# EAGLE design PCB-TBAR-BORADC (EAGLE 7.7.0)
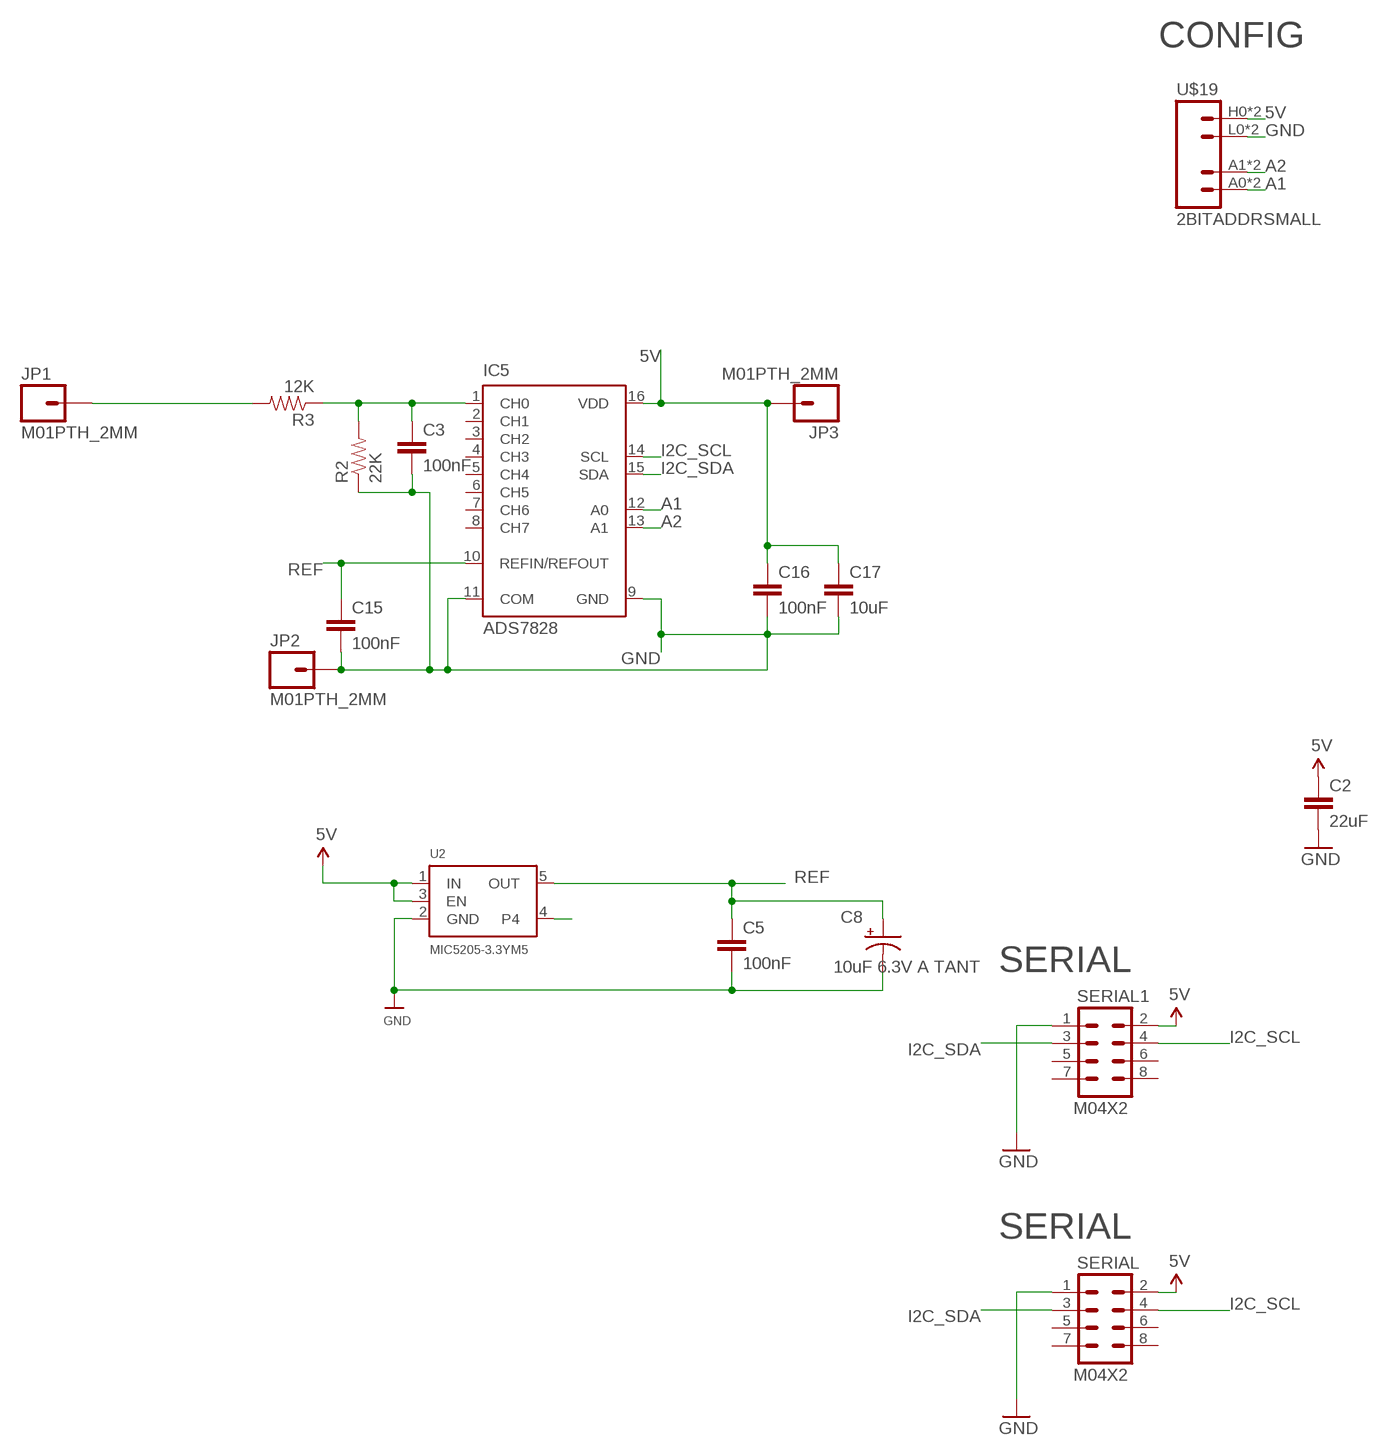
[diagram p0: schematic, sheet 1]

## Parts
C2  22uF  CAP0805  [0805]
C3  100nF  CAP0603-CAP  [0603-CAP]
C5  100nF  CAP0603-CAP  [0603-CAP]
C8  10uF 6.3V A TANT  CAP_POL1206  [EIA3216]
C15  100nF  CAP0603-CAP  [0603-CAP]
C16  100nF  CAP0603-CAP  [0603-CAP]
C17  10uF  CAP0805  [0805]
IC5  ADS7828  [TSSOP16-PW]
JP1  M01PTH_2MM  [1X01_2MM]
JP2  M01PTH_2MM  [1X01_2MM]
JP3  M01PTH_2MM  [1X01_2MM]
R2  22K  RESISTOR0603-RES  [0603-RES]
R3  12K  RESISTOR0603-RES  [0603-RES]
SERIAL  M04X2  [2X4]
SERIAL1  M04X2  [2X4]
U2  MIC5205-3.3YM5  VREG_SOT23-5  [SOT23-5]
U$19  2BITADDRSMALL  [2BITADDR_SMALL]

## Nets
5V [Power]: C2.1 C16.1 C17.1 IC5.16(VDD) JP3.1 SERIAL1.2 SERIAL.2 U2.1(IN) U2.3(EN) U$19.H0(VCC) U$19.H1(VCC)
A1: IC5.12(A0) U$19.A0(A1) U$19.AS0(A1)
A2: IC5.13(A1) U$19.A1(A2) U$19.AS1(A2)
GND [Power]: C2.2 C3.2 C5.2 C8.C(-) C15.2 C16.2 C17.2 IC5.9(GND) IC5.11(COM) JP2.1 R2.1 SERIAL1.1 SERIAL.1 U2.2(GND) U$19.L0(GND) U$19.L1(GND)
I2C_SCL: IC5.14(SCL) SERIAL1.4 SERIAL.4
I2C_SDA: IC5.15(SDA) SERIAL1.3 SERIAL.3
N$1: C3.1 IC5.1(CH0) R2.2 R3.1
N$2: JP1.1 R3.2
N$3 [Power]: U2.4
REF [Power]: C5.1 C8.A(+) C15.1 IC5.10(REFIN/REFOUT) U2.5(OUT)
Unconnected: IC5.2(CH1) IC5.3(CH2) IC5.4(CH3) IC5.5(CH4) IC5.6(CH5) IC5.7(CH6) IC5.8(CH7) SERIAL1.5 SERIAL1.6 SERIAL1.7 SERIAL1.8 SERIAL.5 SERIAL.6 SERIAL.7 SERIAL.8

## Notes on the sheet
- CONFIG
- SERIAL
- SERIAL

## Library data of the parts
C2 C3 C5 C15-C17 = SparkFun:CAP: Capacitor Standard 0603 ceramic capacitor, and 0.1" leaded capacitor.
C8 = freetronics:CAP_POL: Capacitor Polarized These are standard SMD and PTH capacitors. Normally 10uF, 47uF, and 100uF in electrolytic and tantalum varieties. Always verify the external diameter of the through hole cap, it varies with capacity, voltage, and manufacturer. The EIA devices should be standard.
IC5 = burr-brown:ADS7828: 12-Bit, 8-Channel Sampling ANALOG-TO-DIGITAL CONVERTER with I2C? Interface Source: www.ti.com .. ADS7828.pdf; MF: TEXAS INSTRUMENTS; MPN: ADS7828E/250; OC_FARNELL: 1470338; OC_NEWARK: 74C7158
JP1-JP3 = SparkFun:M01: Header 1 Standard 1-pin 0.1" header. Use with straight break away headers (SKU : PRT-00116), right angle break away headers (PRT-00553), swiss pins (PRT-00743), machine pins (PRT-00117), and female headers (PRT-00115).
R2 R3 = SparkFun:RESISTOR: Resistor Basic schematic elements and footprints for 0603, 1206, and PTH resistors.
SERIAL SERIAL1 = SparkFun:M04X2
U2 = microbuilder:VREG_SOT23-5: SOT23-5 Fixed Voltage Regulators To better organise some of the SOT23-5 fixed voltage regulators in this library, this new part was created. Part Current Out V Out V In V Dropout Digikey Part No. ADP121 150mA 3.3V 3.4-5.5V 0.09V @ 150mA ADP121-AUJZ33R7CT-ND ADP121 150mA 3.0V 3.1-5.5V 0.09V @ 150mA ADP121-AUJZ30R7CT-ND ADP122 300mA 3.3V 3.4-5.5V 0.085V @ 300mA ADP122AUJZ-3.3-R7CT-ND ADP1712 300mA 3.3V 3.5-5.5V 0.17V @ 300mA ADP1712AUJZ-3.3-R7TR-ND AP7311 (Low Cost) 150mA 3.3V 3.5-6V 0.15V @ 150mA AP7311-33WG-7DICT-ND LD39015M18R 150mA 1.8V 1.9V-5.5V 0.08V @ 100mA 497-6977-1-ND MCP1824T-3302E/OT 300mA 3.3V 3.5V-6V 0.2V @ 300mA MCP1824T-3302E/OTCT-ND MIC5205-2.5YM5 TR 150mA 2.5V 2.7-16V 0.165V @ 150mA 576-1257-2-ND MIC5205-3.0YM5 TR 150mA 3.0V 3.2V-16V 0.165V @ 150mA 576-1258-2-ND MIC5205-3.3YM5 TR 150mA 3.3V 3.5V-16V 0.165V @ 150mA 576-1259-2-ND TPS780330220 150mA 3.3V+2.2V 3.6-5.5V 250mV Max 296-23332-1-ND TDA3663/N1,135 100mA 3.3V 3.5-45V 0.18V @ 50mA 568-5343-1-ND
U$19 = SKAARHOJ:2BITADDR

## Net classes
0 default: width 0.203 mm, drill 0.406 mm, clearance 0.203 mm
1 Power: width 0.406 mm, drill 0.61 mm, clearance 0.203 mm

## Board
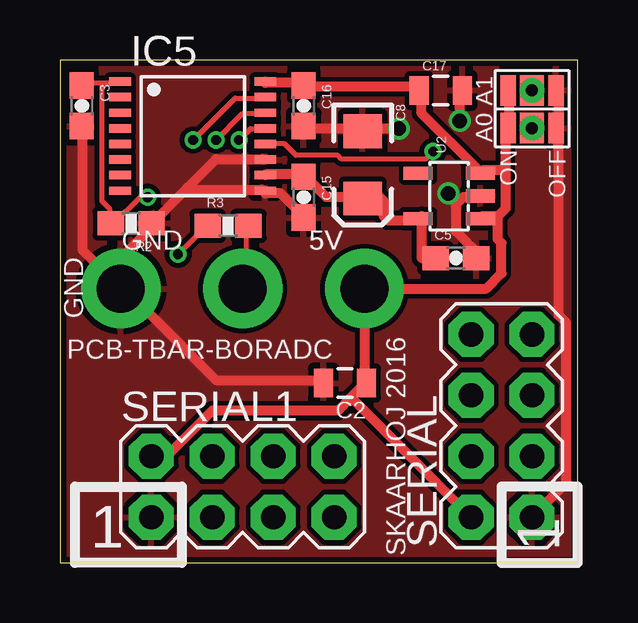
[diagram p1: board, top side]
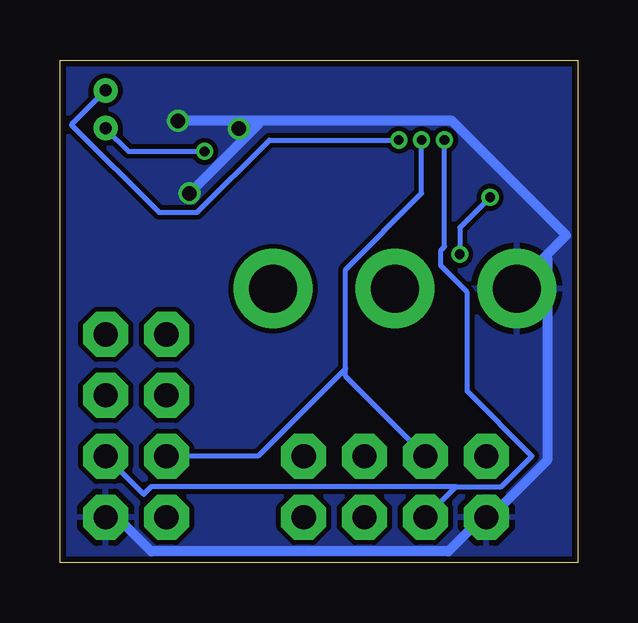
[diagram p2: board, bottom side, seen from below]

Size 21.59 x 20.95 mm. Coordinates in mm from the lower left corner, seen from the top.
Outline: 0,0 21.59,0 21.59,20.95 0,20.95 0,0
Copper layers (1*16): Top 0.035mm / dielectric 1.5mm / Bottom 0.035mm
Design rules "default": minimum track width 6mil, minimum drill 12mil, track to track 6mil, track to pad 6mil, pad to pad 6mil, via to via 6mil, smd to smd 0mil, copper to edge 10mil, drill to drill 10mil, minimum pad ring 10mil, minimum via ring 6mil, stop-mask expansion 2mil, vias tented up to drill 100mil, thermal gap 10mil

### Footprints (pad centres in the part's own frame; a part is rotated, then mirrored left to right if it is on the bottom)
0805 = smd 0.8 x 1.2: 1 -0.9,0; 2 0.9,0
0603-CAP = smd 1.1 x 1: 1 -0.85,0; 2 0.85,0
EIA3216 = smd 1.4 x 1.6: A 1.4,0; C -1.4,0
TSSOP16-PW = smd 0.35 x 0.9: 1 -2.275,-3.025; 2 -1.625,-3.025; 3 -0.975,-3.025; 4 -0.325,-3.025; 5 0.325,-3.025; 6 0.975,-3.025; 7 1.625,-3.025; 8 2.275,-3.025; 9 2.275,3.025; 10 1.625,3.025; 11 0.975,3.025; 12 0.325,3.025; 13 -0.325,3.025; 14 -0.975,3.025; 15 -1.625,3.025; 16 -2.275,3.025
1X01_2MM = drill 2 pad 3.302: 1 0,0
0603-RES = smd 1.1 x 1: 1 -0.85,0; 2 0.85,0
2X4 = drill 1.016 pad 1.88 octagon: 1 -3.81,-1.27; 2 -3.81,1.27; 3 -1.27,-1.27; 4 -1.27,1.27; 5 1.27,-1.27; 6 1.27,1.27; 7 3.81,-1.27; 8 3.81,1.27
SOT23-5 = smd 0.55 x 1.2: 1 -0.95,-1.3; 2 0,-1.3; 3 0.95,-1.3; 4 0.95,1.3; 5 -0.95,1.3
2BITADDR_SMALL = drill 0.5: A0 -1.565,0; A1 0,0 | smd 1.27 x 1: AS0 -1.565,0; AS1 0,0 | smd 1.27 x 0.635: H0 -1.565,1; H1 0,1; L0 -1.565,-1; L1 0,-1

### Placement (x,y rotation side)
C2  11.89,7.49 180 top
C3  0.91,19.05 270 top
C5  16.51,12.7 0 top
C8  12.62,16.59 270 top
C15  10.16,15.24 270 top
C16  10.16,19.05 270 top
C17  15.88,19.68 0 top
IC5  5.54,17.78 270 top
JP1  7.62,11.43 0 top
JP2  2.54,11.43 0 top
JP3  12.7,11.43 0 top
R2  2.97,14.15 180 top
R3  7.01,14.05 0 top
SERIAL  18.41,5.71 90 top
SERIAL1  7.62,3.17 0 top
U2  16.23,15.29 90 top
U$19  19.68,19.68 90 top

### Tracks (layer width: path | path; a pad name or v marks a point on that pad's centre or on a via)
5V
  Top 0.406: IC5.16 8.57,20 10.16,20 C16.1 10.32,19.84 14.92,19.84 C17.1 15.08,19.68 15.08,18.73 17.46,16.35 U2.3 17.62,16.35 18.57,16.35 | 18.26,14.45 17.62,14.45 U2.1 | 18.26,14.45 18.57,14.76 18.57,16.35 | 18.57,16.35 18.57,18.1 U$19.H0 18.73,18.26 18.73,19.68 U$19.H1 | SERIAL1.2 4.45,4.45 6.35,6.35 11.59,6.35 12.14,6.91 | 12.14,6.91 12.7,7.46 C2.1 12.7,7.62 JP3.1 17.78,11.43 18.41,12.06 18.41,13.34 18.26,13.49 18.26,14.45 | 12.14,6.91 SERIAL.2
A1  (via drill 0.41)
  Top 0.203: v15.56,17.14 15.24,16.83 11.75,16.83 11.59,16.99 9.84,16.99 9.37,17.46 8.57,17.46 IC5.12 | 19.68,18.1 U$19.A0
  Bottom 0.203: v15.56,17.14 18.73,17.14 19.68,18.1 U$19.A0
A2  (via drill 0.41)
  Top 0.203: v7.46,17.62 7.94,18.1 8.41,18.1 IC5.13
  Bottom 0.203: v7.46,17.62 12.86,17.62 15.88,14.61 17.46,14.61 21.11,18.26 U$19.A1
GND  (via drill 0.61)
  Top 0.406: U$19.L1 20.8,19.68 20.8,18.26 U$19.L0 20.8,17.94 20.8,10.32 21.11,10 21.11,3.33 SERIAL.1 | C15.2 10.16,14.45 9.21,15.4 8.57,15.4 IC5.9 8.41,15.56 5.4,15.56 5.32,15.64 | 5.32,15.64 3.97,14.29 R2.1 3.81,13.97 1.91,12.06 | 5.32,15.64 6.51,16.83 8.41,16.83 IC5.11 | C16.2 10.16,18.1 12.54,18.1 C8.C 12.7,18.1 v14.13,18.1 | 16.51,14.92 16.51,13.81 17.3,13.02 17.3,12.7 C5.2 | 16.51,14.92 16.83,15.24 17.46,15.24 U2.2 | 1.91,12.06 0.95,13.02 0.95,18.1 C3.2 | C2.2 10.95,7.62 6.51,7.62 2.7,11.43 JP2.1 1.91,12.06 | v16.67,18.41 16.67,19.68 C17.2 | v16.19,15.4 16.51,15.08 16.51,14.92
  Bottom 0.406: 13.34,18.41 5.24,18.41 0.48,13.65 1.35,12.78 | 13.34,18.41 14.13,18.41 | 14.13,18.41 v16.67,18.41 | 1.35,12.78 2.54,11.59 JP2.1 | v16.19,15.4 13.34,18.26 13.34,18.41 | v14.13,18.1 14.13,18.41 | 1.35,12.78 1.27,12.7 1.27,4.29 3.65,1.91 SERIAL1.1 3.97,1.91 5.4,0.48 17.78,0.48 19.21,1.91 SERIAL.1
  pour Top: 0,0 21.59,0 21.59,20.95 0,20.95
  pour Bottom: 0,0 21.59,0 21.59,20.95 0,20.95
I2C_SCL  (via drill 0.41)
  Top 0.203: v6.51,17.62 7.62,18.73 8.41,18.73 IC5.14
  Bottom 0.203: v6.51,17.62 6.51,15.4 9.68,12.22 9.68,8.1 | 9.68,8.1 9.68,7.78 SERIAL1.4 | SERIAL.4 13.34,4.45 9.68,8.1
I2C_SDA  (via drill 0.41)
  Top 0.203: v5.56,17.62 7.3,19.37 8.41,19.37 IC5.15
  Bottom 0.203: v5.56,17.62 5.56,13.18 5.71,13.02 5.71,12.38 4.6,11.27 4.6,7.14 1.91,4.45 3.17,3.17 5.08,3.17 | SERIAL1.3 5.08,3.17 | SERIAL.3 18.1,2.86 17.78,3.17 5.08,3.17
N$1  (via drill 0.41)
  Top 0.203: 1.75,20 0.95,20 C3.1 | 1.75,20 2.38,20 IC5.1 | 1.75,20 1.75,15.08 2.06,14.76 2.06,14.29 R2.2 2.22,14.13 3.33,15.24 v3.65,15.24 | v4.92,12.86 6.03,13.97 R3.1
  Bottom 0.203: v4.92,12.86 4.92,13.97 v3.65,15.24
N$2
  Top 0.203: JP1.1 7.78,11.59 7.78,13.97 R3.2
REF
  Top 0.406: C5.1 15.08,12.7 15.08,14.13 15.24,14.29 15.08,14.45 U2.5 14.76,14.29 13.65,14.29 13.49,14.45 13.49,15.08 13.34,15.24 12.7,15.24 C8.A 12.54,15.24 11.11,15.24 10.32,16.03 C15.1 10.16,16.19 8.57,16.19 IC5.10

### Text on the board
_tsilk: GND | 5V | 5V | GND | PCB-TBAR-BORADC | 1 | 1 | SKAARHOJ 2016